# EAGLE design ATTinyKnob (EAGLE 9.6.2)
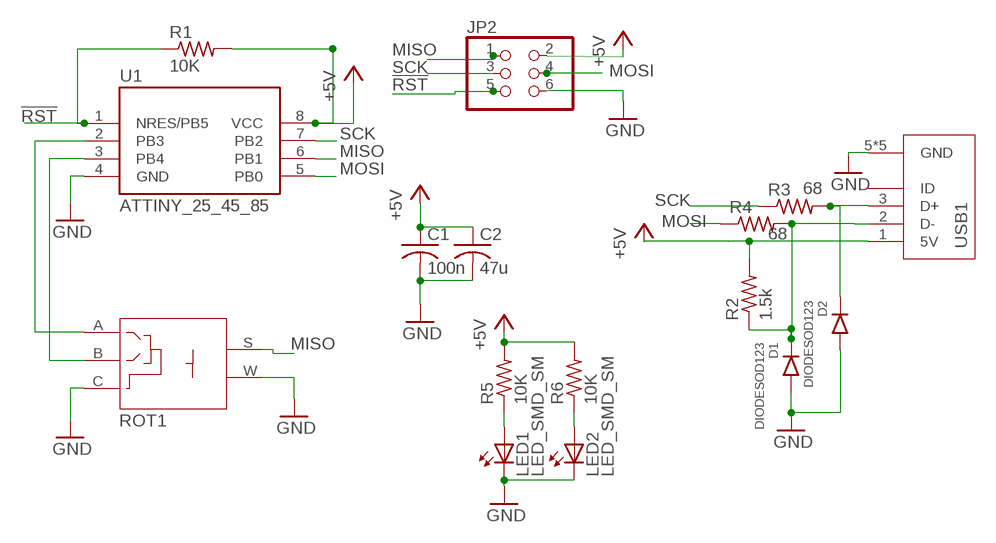
[diagram p0: schematic, sheet 1]

## Parts
C1  100n  C-USC0805  [C0805]
C2  47u  C-USC0805  [C0805]
D1  DIODESOD123  [SOD123]
D2  DIODESOD123  [SOD123]
JP2  PINHD-2X3  [2X03]
LED1  LED_SMD_SM  [LED_SMD_SM]
LED2  LED_SMD_SM  [LED_SMD_SM]
R1  10K  R-US_M1206  [M1206]
R2  1.5k  R-US_M1206  [M1206]
R3  68  R-US_M1206  [M1206]
R4  68  R-US_M1206  [M1206]
R5  10K  R-US_M1206  [M1206]
R6  10K  R-US_M1206  [M1206]
ROT1  ROTARY_EC16  [ROTARY_EC16]
U1  ATTINY_25_45_85  [SOIC-8]
USB1  USB_MINIUSB_MINI_TH_RIGHTANG  [USB_MINI_TH_RIGHTANGLE]

## Nets
!RST: JP2.5 R1.1 U1.1(NRES/PB5)
+5V: C1.1 C2.1 JP2.2 R1.2 R2.2 R5.2 R6.2 U1.8(VCC) USB1.1(5V)
GND: C1.2 C2.2 D1.1(A) D2.1(A) JP2.6 LED1.2(C) LED2.2(C) ROT1.C(COM) ROT1.W U1.4(GND) USB1.5(GND) USB1.6(GND) USB1.7(GND) USB1.8(GND) USB1.9(GND)
MISO: JP2.1 ROT1.S U1.6(PB1)
MOSI: JP2.4 R4.1 U1.5(PB0)
N$1: ROT1.A U1.2(PB3)
N$2: ROT1.B U1.3(PB4)
N$4: D2.2(C) R3.2 USB1.3(D+)
N$6: D1.2(C) R2.1 R4.2 USB1.2(D-)
N$7: LED2.1(A) R6.1
N$8: LED1.1(A) R5.1
SCK: JP2.3 R3.1 U1.7(PB2)
Unconnected: USB1.4(ID)

## Library data of the parts
C1 C2 = DR:C-US: CAPACITOR, American symbol
D1 D2 = DR:DIODE
JP2 = pinhead:PINHD-2X3: PIN HEADER
LED1 LED2 = DR:LED_SMD_SM
R1-R6 = DR:R-US_: RESISTOR, American symbol
ROT1 = DR:ROTARY_EC16: Rotary Encoder Switch with Detent Switch
U1 = DR:ATTINY_25_45_85
USB1 = DR:USB_MINI

## Board
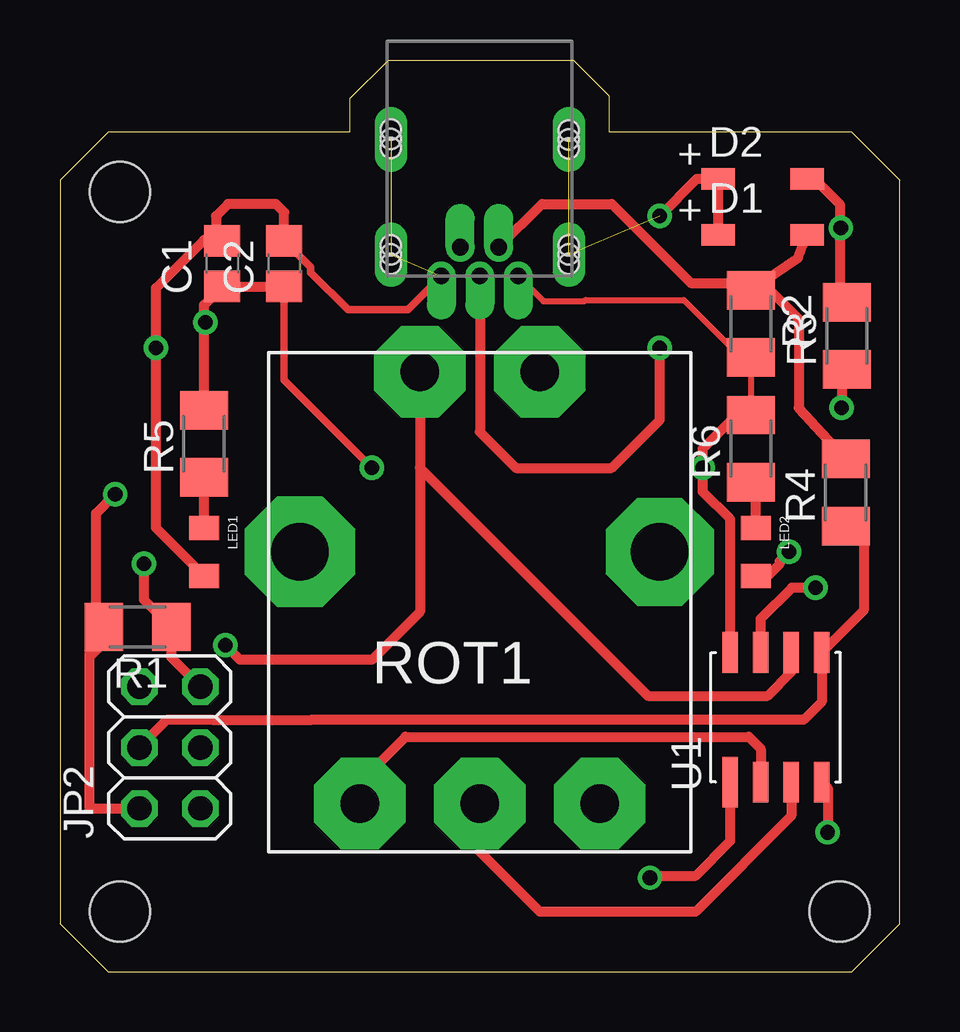
[diagram p1: board, top side]
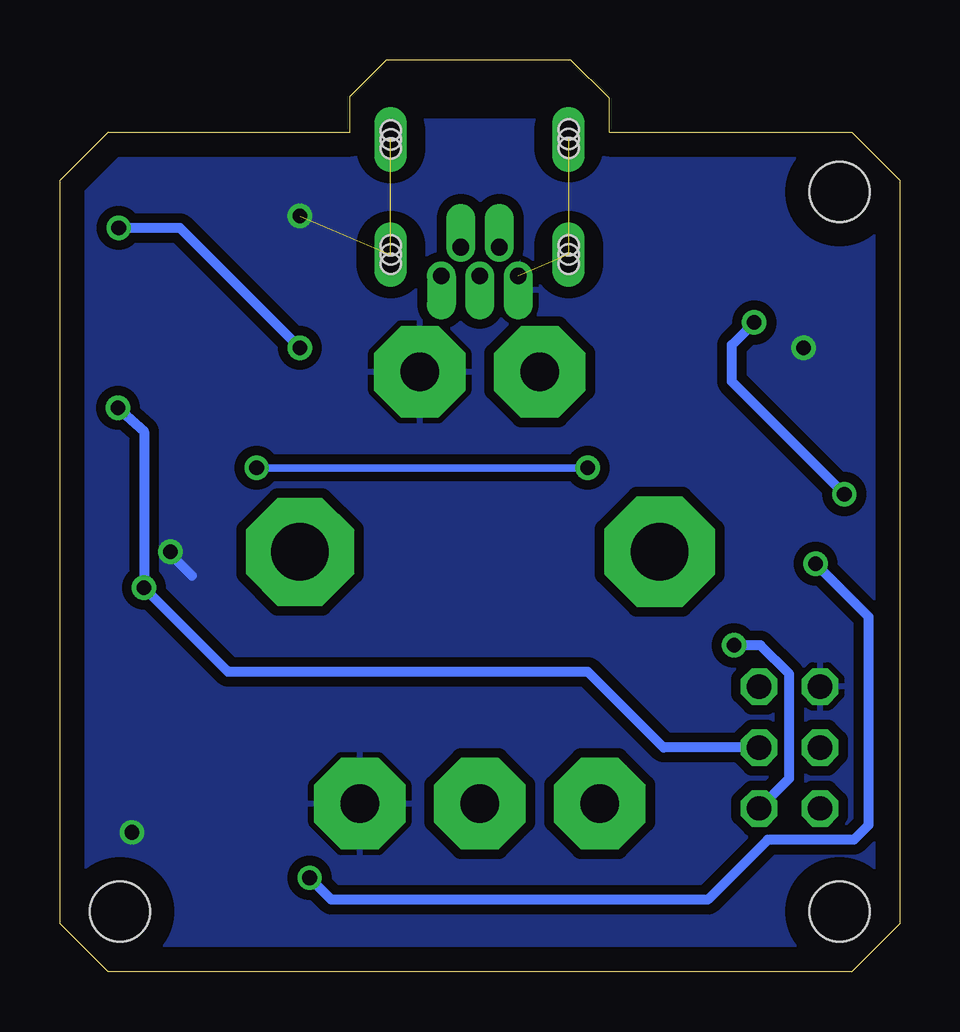
[diagram p2: board, bottom side, seen from below]

Size 35 x 38 mm. Coordinates in mm from the lower left corner, seen from the top.
Outline: 2,0 33,0 35,2 35,33 33,35 22.9,35 22.9,36.5 21.4,38 13.7,38 12.1,36.4 12.1,35 2,35 0,33 0,2 2,0
Copper layers (1*16): Top 0.035mm / dielectric 1.5mm / Bottom 0.035mm
Design rules "default": minimum track width 10mil, minimum drill 24mil, track to track 8mil, track to pad 8mil, pad to pad 8mil, via to via 8mil, smd to smd 8mil, copper to edge 40mil, drill to drill 8mil, minimum pad ring 10mil, minimum via ring 8mil, stop-mask expansion 4mil, vias tented up to drill 0mil, thermal gap 10mil
Holes 2.5 mm at 2.5,2.5 2.5,32.5 32.5,2.5

### Footprints (pad centres in the part's own frame; a part is rotated, then mirrored left to right if it is on the bottom)
C0805 = smd 1.3 x 1.5: 1 -0.95,0; 2 0.95,0
SOD123 = smd 1.4 x 0.9: 1 0,0; 2 3.7,0
2X03 = drill 1.016 octagon: 1 -2.54,-1.27; 2 -2.54,1.27; 3 0,-1.27; 4 0,1.27; 5 2.54,-1.27; 6 2.54,1.27
LED_SMD_SM = smd 1 x 1.25: 1 0,0; 2 2,0
M1206 = smd 1.6 x 2: 1 -1.4,0; 2 1.4,0
ROTARY_EC16 = drill 1.6 pad 3.81 octagon: A -5,-10.5; B 0,-10.5; C 5,-10.5; S -2.5,7.5; W 2.5,7.5 | drill 2.4 pad 4.6 octagon: H1 -7.5,0 | drill 2.4 pad 4.5 octagon: H2 7.5,0
SOIC-8 = smd 2.1 x 0.635: 1 0,0 | smd 1.7 x 0.635: 2 0,-1.27; 3 0,-2.54; 4 0,-3.81; 5 5.4,-3.81; 6 5.4,-2.54; 7 5.4,-1.27; 8 5.4,0
USB_MINI_TH_RIGHTANGLE = drill 0.7 pad 1.067 offset: 1 3.2,0; 2 2.388,1.194; 3 1.6,0; 4 0.787,1.194; 5 0,0 | drill 0.61 pad 1.346 long: 6 -2.108,5.69; 7 -2.108,0.889; 8 5.309,5.69; 9 5.309,0.889 | hole 0.838: -2.108,5.334; -2.108,6.096; -2.108,5.715; 5.309,5.309; 5.309,6.071; 5.309,5.69; -2.108,0.508; -2.108,1.27; -2.108,0.889; 5.309,0.508; 5.309,1.27; 5.309,0.889

### Placement (x,y rotation side)
C1  6.77,29.51 90 top
C2  9.35,29.51 90 top
D1  27.44,30.71 0 top
D2  27.44,33.05 0 top
JP2  4.58,9.34 90 top
LED1  6,18.5 270 top
LED2  29,18.5 270 top
R1  3.24,14.36 180 top
R2  28.8,27 270 top
R3  32.8,26.5 90 top
R4  32.75,19.97 90 top
R5  6,22 90 top
R6  28.8,21.8 90 top
ROT1  17.5,17.5 0 top
U1  27.94,7.9 90 top
USB1  15.9,29 0 top

### Tracks (layer width: path | path; a pad name or v marks a point on that pad's centre or on a via)
!RST  (via drill 0.61)
  Top 0.406: U1.1 27.94,5.44 26.5,4 24.69,4 v24.59,3.91 | JP2.5 4.64,13.09 R1.1 3.5,15.5 v3.5,17
  Bottom 0.406: v3.5,17 1.3,14.8 1.3,6.1 1.9,5.5 5.5,5.5 8,3 23.69,3 v24.59,3.91
+5V  (via drill 0.61)
  Top 0.254: USB1.1 20.15,27.95 21.86,27.95 21.91,28 26,28 28.4,25.6 R2.2 R6.2 | 1.5,14.7 1.6,14.6 1.84,14.84 | 1.84,14.84 R1.2 1.84,13.62 1.22,13 | 1.84,14.84 2,15
  Top 0.305: C2.1 9.35,24.65 v13,21
  Top 0.406: R5.2 6,27 | 6,27 6,27.79 C1.1 C2.1 | U1.8 27.94,18.86 26.8,20 v26.8,21 26.8,21.8 28.2,23.2 R6.2 | v6.06,27.06 6,27 | 1.5,14.7 1.5,19.1 v2.3,19.9 | 1.22,13.74 1.22,13 1.22,6.8 JP2.2
  Bottom 0.305: v13,21 v26.8,21
  Bottom 0.406: v2.3,19.9 7,24.6 7,26.12 v6.06,27.06
GND  (via drill 0.61)  (4 unrouted)
  Top 0.305: USB1.5 14.5,27.6 12,27.6 10.46,29.14 10.46,29.36 10.25,29.57 10.24,29.57 C2.2
  Top 0.406: LED1.2 4,18.5 v4,26 4,28.5 6,30.5 6.73,30.5 C1.2 6.5,30.73 6.5,31.5 7,32 9,32 9.35,31.65 C2.2 | v25,31.5 26.55,33.05 D2.1 D1.1 | U1.4 32,7.65 v32,5.8 | LED2.2 29.5,16.5 30,17 30,17.1 v30.4,17.5
  Bottom 0.406: v32,5.8 32,5.5 | v30.4,17.5 30.4,17.4 29.5,16.5
  pour Bottom (isolate 0.406): -0.5,35.5 35.5,35.5 35.5,0 -0.5,0
MISO  (via drill 0.61)
  Top 0.406: U1.6 30.48,12.48 29.5,11.5 24.5,11.5 15,21 ROT1.S 15,15 13,13 7.5,13 v6.9,13.6
  Bottom 0.406: JP2.1 4.6,8.05 4.6,12.4 5.8,13.6 v6.9,13.6
MOSI
  Top 0.406: R4.1 33.5,17.82 33.5,15.05 U1.5 31.75,11.25 31,10.5 10.5,10.5 6.34,10.5 6.33,10.51 4.48,10.51 JP2.4
N$1
  Top 0.406: ROT1.A 12.5,7.89 14.4,9.79 28.71,9.79 29.21,9.29 U1.2
N$2
  Top 0.406: ROT1.B 17.5,5 20,2.5 26.5,2.5 30.48,6.48 U1.3
N$4  (via drill 0.61)
  Top 0.406: D2.2 31.45,33.05 32.5,32 32.5,31 | 32.5,31 32.5,28.16 R3.2 | USB1.3 17.5,22.5 19,21 23,21 25,23 v25,26 | v32.55,31 32.5,31
  Bottom 0.406: v25,26 30,31 v32.55,31
N$6
  Top 0.406: R2.1 30.76,29.74 D1.2 | R4.2 30.8,23.5 30.8,27.2 29.6,28.4 R2.1 | R2.1 28.2,28.7 26.3,28.7 23,32 20.09,32 USB1.2
N$7
  Top 0.406: LED2.1 29,20.24 R6.1
N$8
  Top 0.406: LED1.1 R5.1
SCK  (via drill 0.61)
  Top 0.305: R3.1 32.58,25.02
  Top 0.406: v31.5,16 30.5,16 29.2,14.7 U1.7 | 32.58,25.02 v32.58,23.5
  Bottom 0.406: v32.58,23.5 31.5,22.52 v31.5,16 28,12.5 13,12.5 9.84,9.34 JP2.3